# Altium schematic sheet Mech.SchDoc
size A4; SheetNumber: 5; SheetTotal: 11
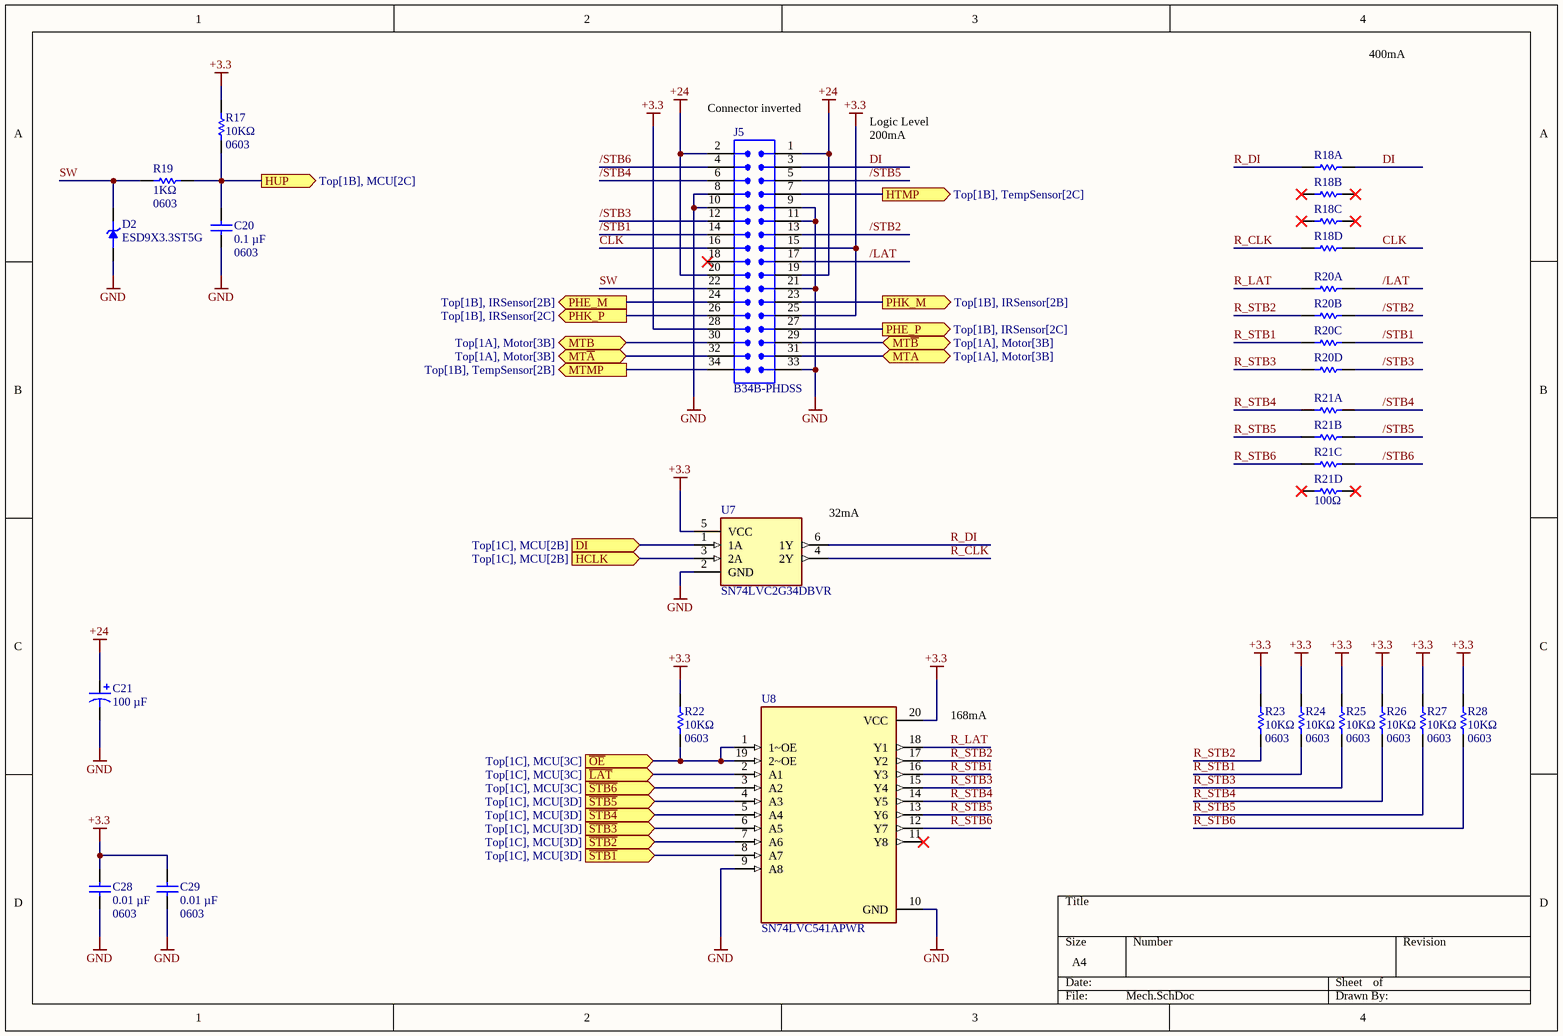
[diagram p0: Mech.SchDoc]

## Parts
C20  value 0.1 µF  [0603]  (hidden comment: GRM188R72A104MA35J)
C21  value 100 µF  [Radial 6.60x6.60]  (hidden comment: EEE-FTH101XAP)
C28  value 0.01 µF  [0603]  (hidden comment: GRM188R72A103KA01D)
C29  value 0.01 µF  [0603]  (hidden comment: GRM188R72A103KA01D)
D2  ESD9X3.3ST5G  [SOD923]
J5  B34B-PHDSS  [34POS]
R17  value 10KΩ  [0603]  (hidden comment: RMCF0603FG10K0)
R18  YC164-JR-07100RL  [1206]  (value not drawn)  (parts A,B,C,D of 4)
R19  value 1KΩ  [0603]  (hidden comment: RMCF0603FG1K00)
R20  YC164-JR-07100RL  [1206]  (value not drawn)  (parts A,B,C,D of 4)
R21  YC164-JR-07100RL  [1206]  (value not drawn)  (parts A,B,C,D of 4)
R22  value 10KΩ  [0603]  (hidden comment: RMCF0603FG10K0)
R23  value 10KΩ  [0603]  (hidden comment: RMCF0603FG10K0)
R24  value 10KΩ  [0603]  (hidden comment: RMCF0603FG10K0)
R25  value 10KΩ  [0603]  (hidden comment: RMCF0603FG10K0)
R26  value 10KΩ  [0603]  (hidden comment: RMCF0603FG10K0)
R27  value 10KΩ  [0603]  (hidden comment: RMCF0603FG10K0)
R28  value 10KΩ  [0603]  (hidden comment: RMCF0603FG10K0)
U7  SN74LVC2G34DBVR  [SOT-23-6]
U8  SN74LVC541APWR  [20-TSSOP]

## Ports
DI (in, see Top[1C], MCU[2B]), HCLK (in, see Top[1C], MCU[2B]), HTMP (out, see Top[1B], TempSensor[2C]), HUP (out, see Top[1B], MCU[2C]), MTA (bidir, see Top[1A], Motor[3B]), MTB (bidir, see Top[1A], Motor[3B]), MTMP (out, see Top[1B], TempSensor[2B]), MT~{A} (bidir, see Top[1A], Motor[3B]), MT~{B} (bidir, see Top[1A], Motor[3B]), PHE_M (out, see Top[1B], IRSensor[2B]), PHE_P (out, see Top[1B], IRSensor[2C]), PHK_M (out, see Top[1B], IRSensor[2B]), PHK_P (out, see Top[1B], IRSensor[2C]), ~{LAT} (in, see Top[1C], MCU[3C]), ~{OE} (in, see Top[1C], MCU[3C]), ~{STB1} (in, see Top[1C], MCU[3D]), ~{STB2} (in, see Top[1C], MCU[3D]), ~{STB3} (in, see Top[1C], MCU[3D]), ~{STB4} (in, see Top[1C], MCU[3D]), ~{STB5} (in, see Top[1C], MCU[3D]), ~{STB6} (in, see Top[1C], MCU[3C])

## Nets
+3.3: C28.2 C29.2 J5.15 J5.25 J5.28 R17.2 R22.2 R23.2 R24.2 R25.2 R26.2 R27.2 R28.2 U7.5(VCC) U8.20(VCC)
+24: C21.1 J5.1 J5.2 J5.19 J5.20
GND: C20.2 C21.2 C28.1 C29.1 D2.2(A) J5.8 J5.9 J5.10 J5.11 J5.21 J5.33 U7.2(GND) U8.9(A8) U8.10(GND)
/LAT: J5.17 R20.8
/STB1: J5.14 R20.6
/STB2: J5.13 R20.7
/STB3: J5.12 R20.5
/STB4: J5.6 R21.8
/STB5: J5.5 R21.7
/STB6: J5.4 R21.6
CLK: J5.16 R18.5
DI: U7.1(1A) ; port DI
DI: J5.3 R18.8  [a separate net that carries the same name]
HCLK: U7.3(2A) ; port HCLK
HTMP: J5.7 ; port HTMP
HUP: C20.1 R17.1 R19.1 ; port HUP
~{LAT}: U8.2(A1) ; port ~{LAT}
MTA: J5.31 ; port MTA
MT~{A}: J5.32 ; port MT~{A}
MTB: J5.30 ; port MTB
MT~{B}: J5.29 ; port MT~{B}
MTMP: J5.34 ; port MTMP
~{OE}: R22.1 U8.1(1~OE) U8.19(2~OE) ; port ~{OE}
PHE_M: J5.24 ; port PHE_M
PHE_P: J5.27 ; port PHE_P
PHK_M: J5.23 ; port PHK_M
PHK_P: J5.26 ; port PHK_P
R_CLK: R18.4 U7.4(2Y)
R_DI: R18.1 U7.6(1Y)
R_LAT: R20.1 U8.18(Y1)
R_STB1: R20.3 R24.1 U8.16(Y3)
R_STB2: R20.2 R23.1 U8.17(Y2)
R_STB3: R20.4 R25.1 U8.15(Y4)
R_STB4: R21.1 R26.1 U8.14(Y5)
R_STB5: R21.2 R27.1 U8.13(Y6)
R_STB6: R21.3 R28.1 U8.12(Y7)
~{STB1}: U8.8(A7) ; port ~{STB1}
~{STB2}: U8.7(A6) ; port ~{STB2}
~{STB3}: U8.6(A5) ; port ~{STB3}
~{STB4}: U8.5(A4) ; port ~{STB4}
~{STB5}: U8.4(A3) ; port ~{STB5}
~{STB6}: U8.3(A2) ; port ~{STB6}
SW: D2.1(K) J5.22 R19.2

Not connected (* = marked no-connect by the designer): J5 18*; R18 2* 3* 6* 7*; R21 4* 5*; U8 11(Y8)*

## Notes on the sheet
- (near J5) Connector inverted
- 400mA
- Logic Level
  200mA
- (near U7) 32mA
- 168mA

## Library data of the parts
C20 = GRM188R72A104MA35J: 0.1 µF ±20% 100V Ceramic Capacitor X7R 0603 (1608 Metric); Case: 0603; Tolerance: ±20%; Temperature Coefficient: X7R; Voltage: 100V
C21 = EEE-FTH101XAP: CAP ALUM 100UF 20% 50V SMD; Tolerance: ±20%; Voltage: 50V; Case: Radial
C28 C29 = GRM188R72A103KA01D: 0.01 µF ±10% 100V Ceramic Capacitor X7R 0603 (1608 Metric); Case: 0603; Tolerance: ±10%; Temperature Coefficient: X7R; Voltage: 100V
D2 = ESD9X3.3ST5G: 10.4V Clamp 9.8A (8/20µs) Ipp Tvs Diode Surface Mount SOD-923; Reverse Standoff: 3.3V; Breakdown: 5V; Peak Pulse: 102W; Clamping: 10.4V
J5 = B34B-PHDSS: Connector Header Through Hole 34 position 0.079" (2.00mm)
R17 R22-R28 = RMCF0603FG10K0: 10 kOhms ±1% 0.1W, 1/10W Chip Resistor 0603 (1608 Metric) Automotive AEC-Q200 Thick Film; Case: 0603; Tolerance: 1%; Power: 0.1W
R18 R20 R21 = YC164-JR-07100RL: 100 Ohm ±5% 62.5mW Power Per Element Isolated 4 Resistor Network/Array ±200ppm/°C 1206 (3216 Metric), Convex, Long Side Terminals; Value: 100Ω; Tolerance: ±5%; Power: 62.5mW; Case: 1206
R19 = RMCF0603FG1K00: 1 kOhms ±1% 0.1W, 1/10W Chip Resistor 0603 (1608 Metric) Automotive AEC-Q200 Thick Film; Case: 0603; Tolerance: 1%; Power: 0.1W
U7 = SN74LVC2G34DBVR: Buffer, Non-Inverting 2 Element 1 Bit per Element Push-Pull Output SOT-23-6
U8 = SN74LVC541APWR: Buffer, Non-Inverting 1 Element 8 Bit per Element 3-State Output 20-TSSOP